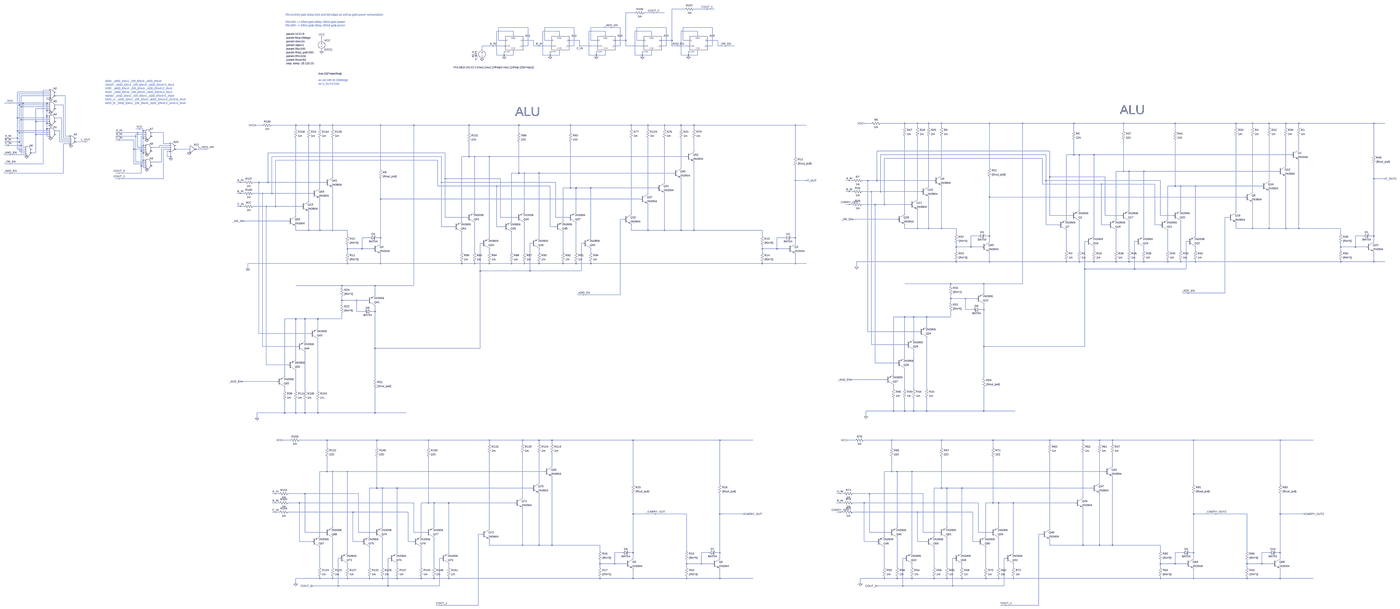
[diagram p0: schematic alu_2bit.asc, whole sheet]
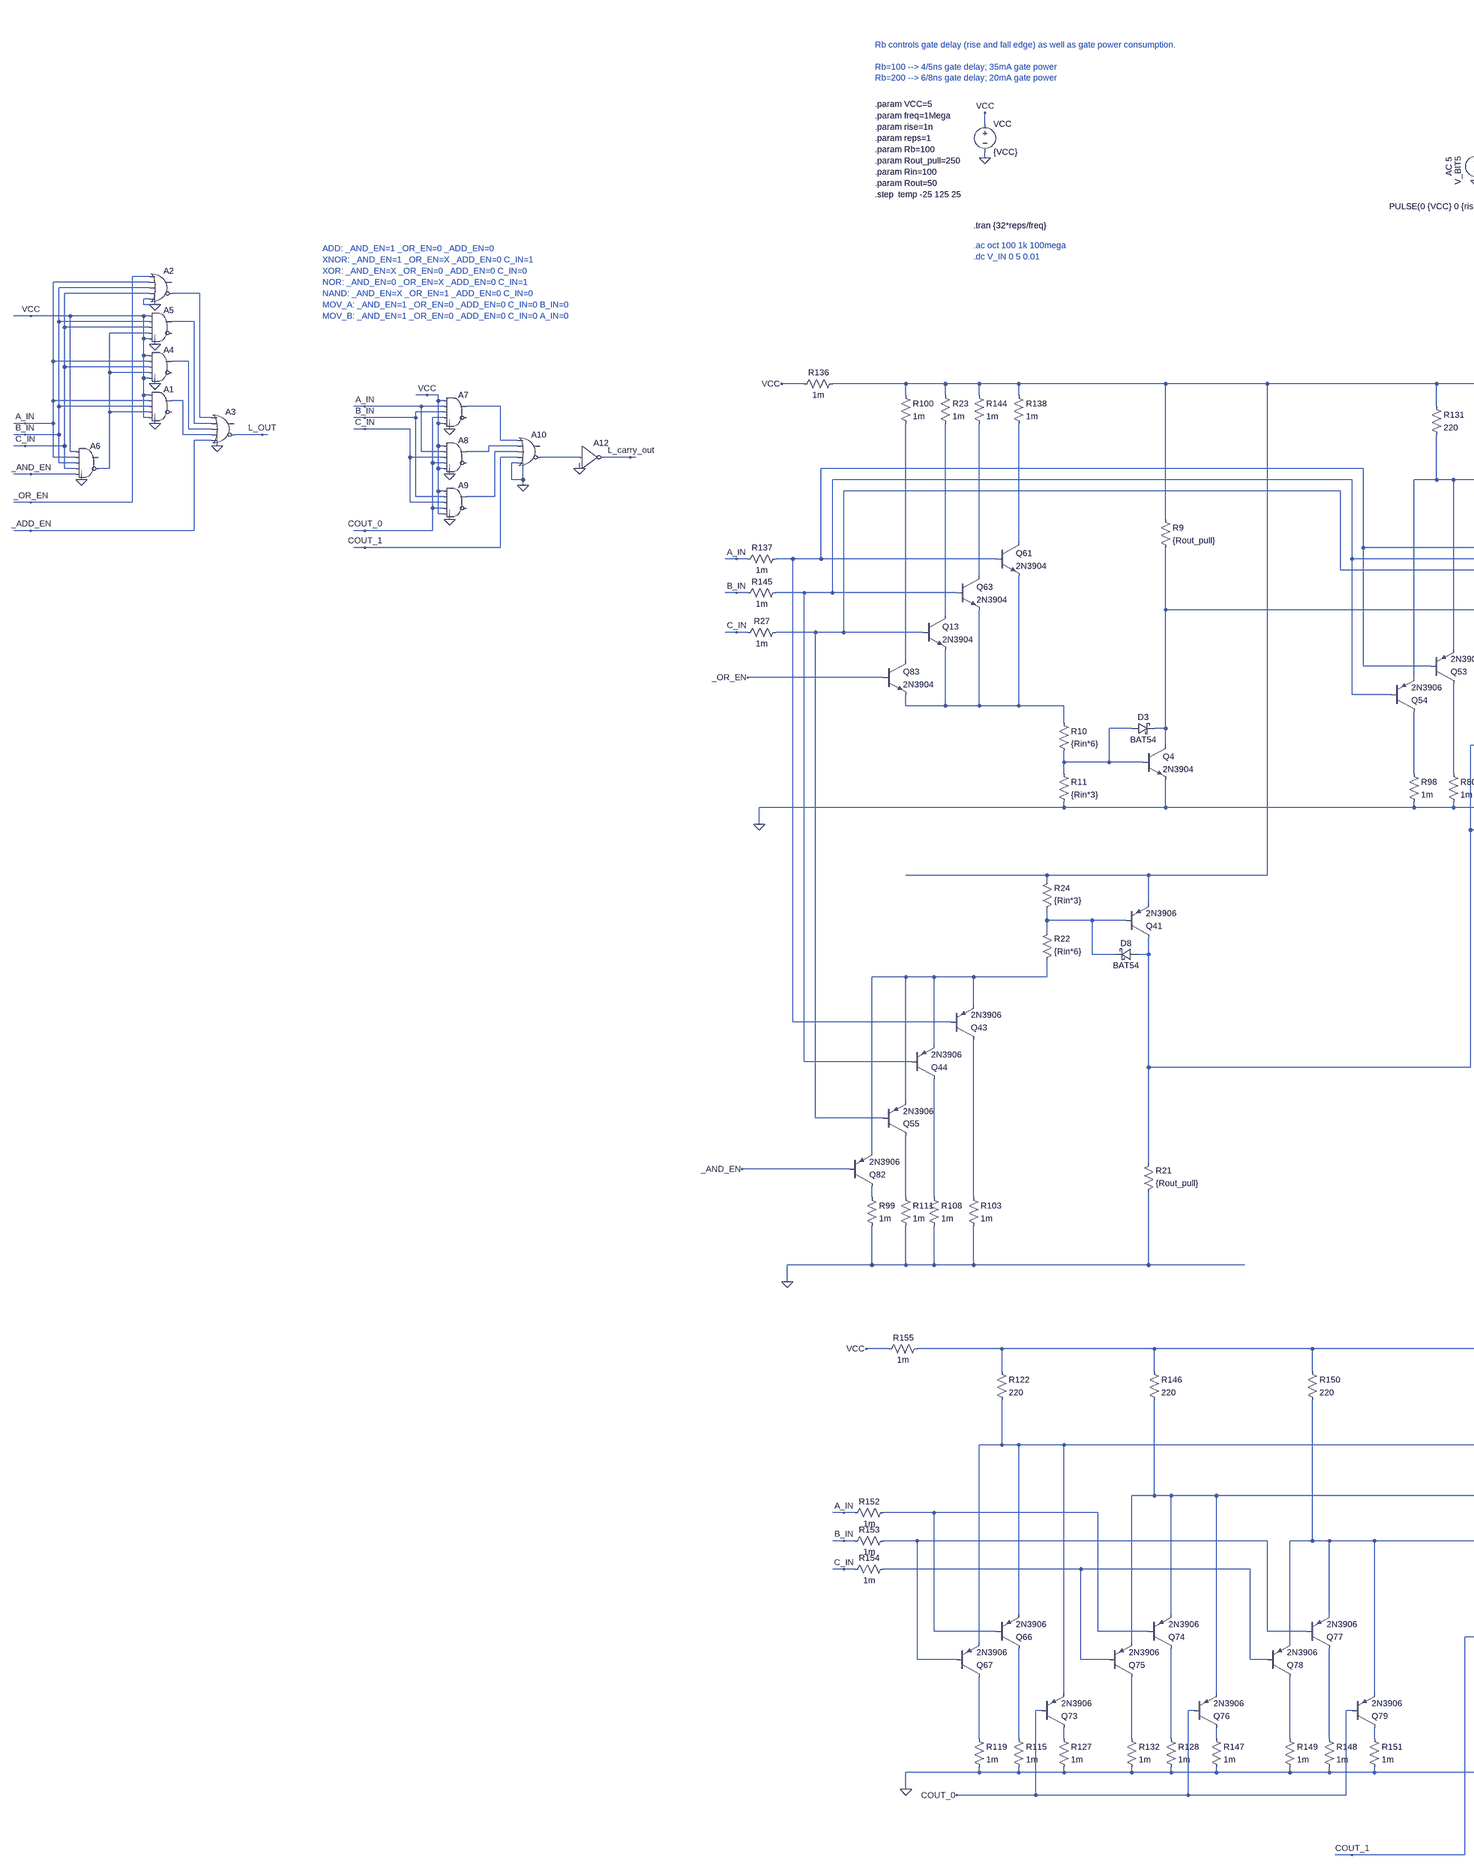
[diagram p1: schematic alu_2bit.asc, part, row 1 of 1, column 1 of 3]
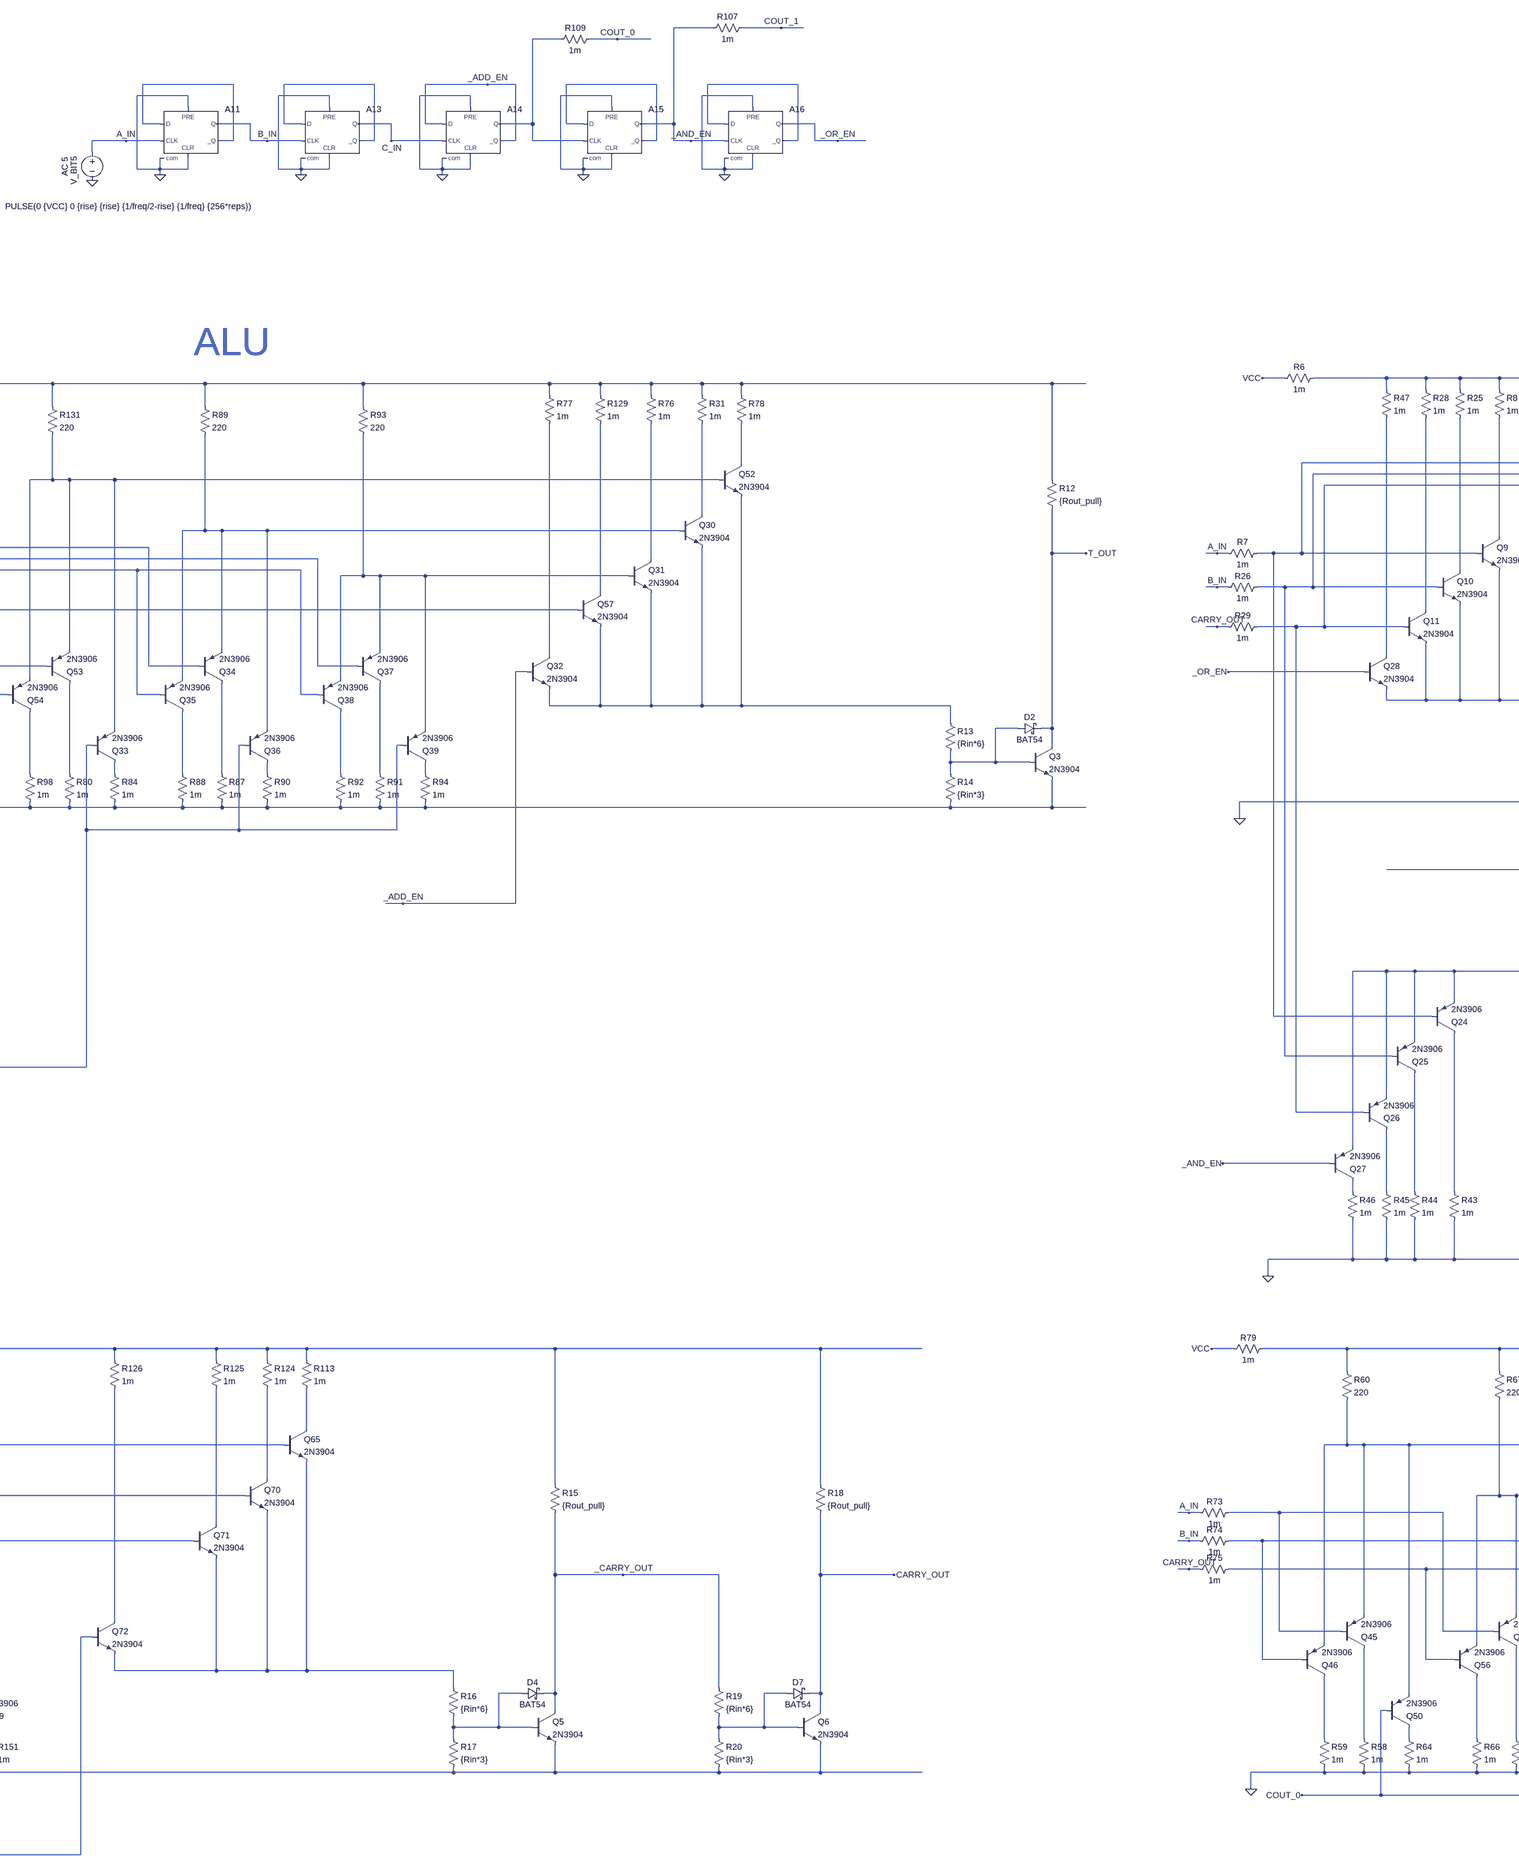
[diagram p2: schematic alu_2bit.asc, part, row 1 of 1, column 2 of 3]
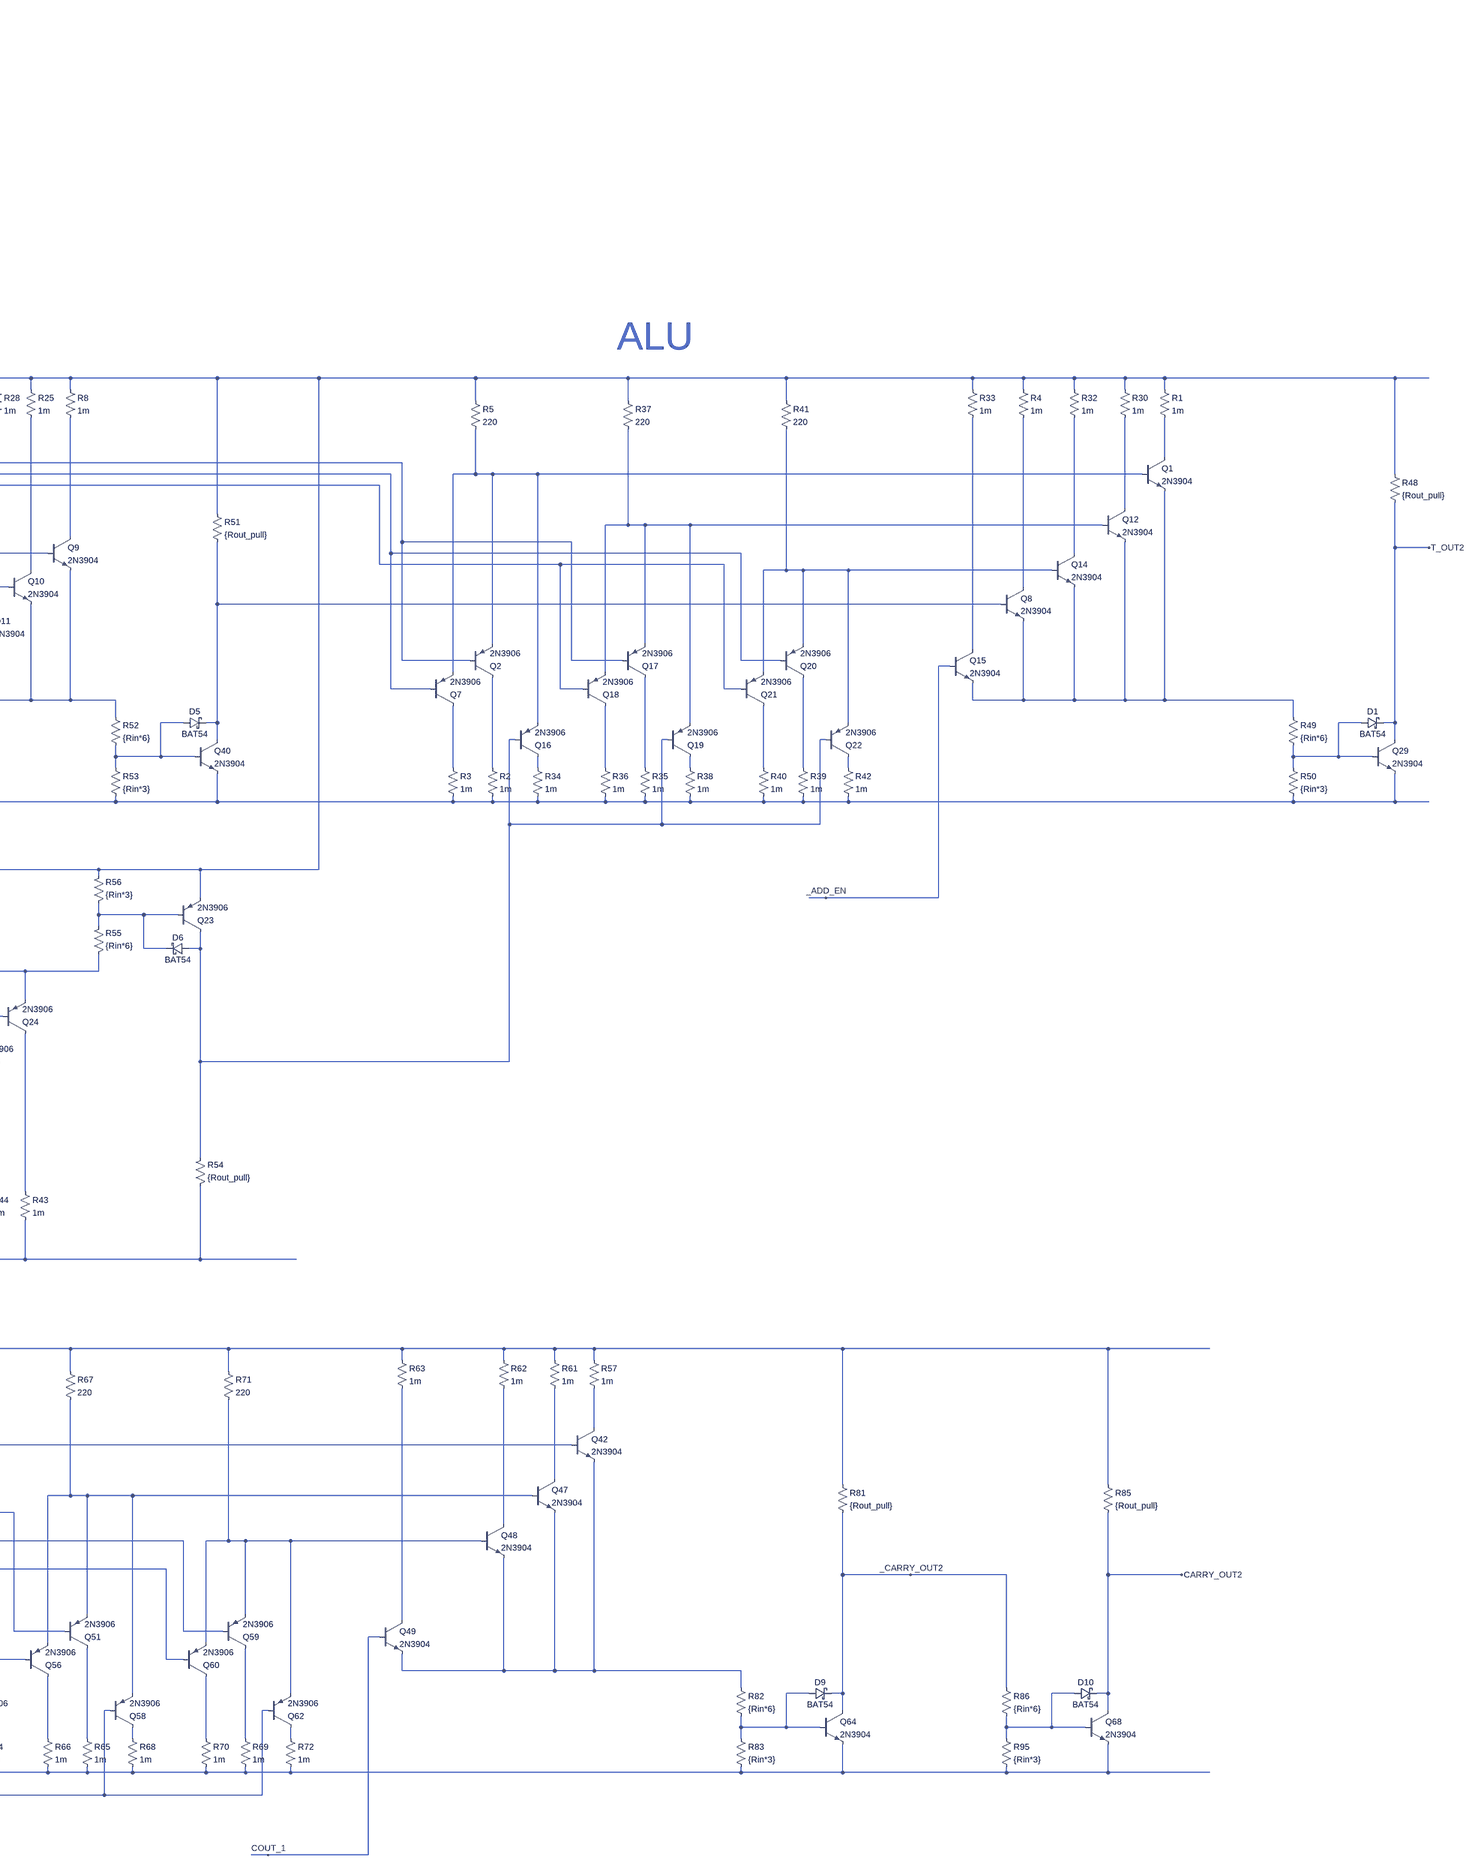
[diagram p3: schematic alu_2bit.asc, part, row 1 of 1, column 3 of 3]
* alu_2bit.asc
VCC VCC 0 {VCC}
Q52 N018 N024 N052 0 2N3904
Q53 N069 N020 N024 0 2N3906
R78 N011 N018 1m
R80 N069 0 1m
Q54 N068 N023 N024 0 2N3906
R98 N068 0 1m
R129 N011 N040 1m
Q57 N040 N042 N052 0 2N3904
R131 N011 N024 220
R136 VCC N011 1m
R137 A_IN N020 1m
Q61 N032 N020 N051 0 2N3904
R138 N011 N032 1m
Q63 N037 N023 N051 0 2N3904
R144 N011 N037 1m
R145 B_IN N023 1m
Q13 N044 N026 N051 0 2N3904
R23 N011 N044 1m
R27 C_IN N026 1m
Q30 N028 N030 N052 0 2N3904
Q31 N034 N038 N052 0 2N3904
Q32 N046 _ADD_EN N052 0 2N3904
R31 N011 N028 1m
R76 N011 N034 1m
R77 N011 N046 1m
Q33 N070 N058 N024 0 2N3906
R84 N070 0 1m
Q34 N072 N020 N030 0 2N3906
R87 N072 0 1m
Q35 N071 N026 N030 0 2N3906
R88 N071 0 1m
R89 N011 N030 220
Q36 N073 N058 N030 0 2N3906
R90 N073 0 1m
Q37 N075 N023 N038 0 2N3906
R91 N075 0 1m
Q38 N074 N026 N038 0 2N3906
R92 N074 0 1m
R93 N011 N038 220
Q39 N076 N058 N038 0 2N3906
R94 N076 0 1m
Q41 N058 N078 N011 0 2N3906
Q43 N088 N020 N080 0 2N3906
R103 N088 0 1m
Q44 N087 N023 N080 0 2N3906
R108 N087 0 1m
Q55 N086 N026 N080 0 2N3906
R111 N086 0 1m
Q65 N091 N093 N111 0 2N3904
Q66 N118 N099 N093 0 2N3906
R113 N089 N091 1m
R115 N118 0 1m
Q67 N117 N103 N093 0 2N3906
R119 N117 0 1m
R122 N089 N093 220
Q70 N095 N097 N111 0 2N3904
Q71 N101 N104 N111 0 2N3904
Q72 N109 COUT_1 N111 0 2N3904
R124 N089 N095 1m
R125 N089 N101 1m
R126 N089 N109 1m
Q73 N119 COUT_0 N093 0 2N3906
R127 N119 0 1m
Q74 N121 N099 N097 0 2N3906
R128 N121 0 1m
Q75 N120 N107 N097 0 2N3906
R132 N120 0 1m
R146 N089 N097 220
Q76 N122 COUT_0 N097 0 2N3906
R147 N122 0 1m
Q77 N124 N103 N104 0 2N3906
R148 N124 0 1m
Q78 N123 N107 N104 0 2N3906
R149 N123 0 1m
R150 N089 N104 220
Q79 N125 COUT_0 N104 0 2N3906
R151 N125 0 1m
R152 A_IN N099 1m
R153 B_IN N103 1m
R154 C_IN N107 1m
R155 VCC N089 1m
A1 VCC A_IN B_IN N008 VCC 0 N012 0 AND Vhigh={VCC}
A3 N006 N007 N009 N012 _ADD_EN L_OUT 0 0 OR Vhigh={VCC}
A4 VCC A_IN C_IN N008 VCC 0 N009 0 AND Vhigh={VCC}
A5 VCC B_IN C_IN N008 VCC 0 N007 0 AND Vhigh={VCC}
A2 _OR_EN A_IN B_IN C_IN 0 N006 0 0 OR Vhigh={VCC}
A6 VCC A_IN B_IN C_IN _AND_EN N008 0 0 AND Vhigh={VCC}
A7 VCC A_IN B_IN COUT_0 VCC 0 N013 0 AND Vhigh={VCC}
A8 VCC A_IN C_IN COUT_0 VCC 0 N014 0 AND Vhigh={VCC}
A9 VCC B_IN C_IN COUT_0 VCC 0 N015 0 AND Vhigh={VCC}
A10 N013 N014 N015 COUT_1 0 N016 0 0 OR Vhigh={VCC}
A12 N016 0 0 0 0 L_carry_out 0 0 BUF Vhigh={VCC}
V_BIT5 A_IN 0 PULSE(0 {VCC} 0 {rise} {rise} {1/freq/2-rise} {1/freq} {256*reps}) AC 5
A11 N002 0 A_IN 0 0 N002 B_IN 0 DFLOP Vhigh={VCC}
A13 N003 0 B_IN 0 0 N003 C_IN 0 DFLOP Vhigh={VCC}
A15 N004 0 N001 0 0 N004 _AND_EN 0 DFLOP Vhigh={VCC}
A16 N005 0 _AND_EN 0 0 N005 _OR_EN 0 DFLOP Vhigh={VCC}
A14 _ADD_EN 0 C_IN 0 0 _ADD_EN N001 0 DFLOP Vhigh={VCC}
Q82 N085 _AND_EN N080 0 2N3906
R99 N085 0 1m
Q83 N048 _OR_EN N051 0 2N3904
R100 N011 N048 1m
R107 COUT_1 _AND_EN 1m
R109 COUT_0 N001 1m
Q3 T_OUT N056 0 0 2N3904
D2 N056 T_OUT BAT54
R12 N011 T_OUT {Rout_pull}
R13 N052 N056 {Rin*6}
R14 N056 0 {Rin*3}
Q4 N042 N055 0 0 2N3904
D3 N055 N042 BAT54
R9 N011 N042 {Rout_pull}
R10 N051 N055 {Rin*6}
R11 N055 0 {Rin*3}
Q5 _CARRY_OUT N113 0 0 2N3904
D4 N113 _CARRY_OUT BAT54
R15 N089 _CARRY_OUT {Rout_pull}
R16 N111 N113 {Rin*6}
R17 N113 0 {Rin*3}
Q6 CARRY_OUT N114 0 0 2N3904
D7 N114 CARRY_OUT BAT54
R18 N089 CARRY_OUT {Rout_pull}
R19 _CARRY_OUT N114 {Rin*6}
R20 N114 0 {Rin*3}
D8 N058 N078 BAT54
R21 0 N058 {Rout_pull}
R22 N080 N078 {Rin*6}
R24 N078 N011 {Rin*3}
Q1 N017 N022 N050 0 2N3904
Q2 N060 N019 N022 0 2N3906
R1 N010 N017 1m
R2 N060 0 1m
Q7 N059 N021 N022 0 2N3906
R3 N059 0 1m
R4 N010 N039 1m
Q8 N039 N041 N050 0 2N3904
R5 N010 N022 220
R6 VCC N010 1m
R7 A_IN N019 1m
Q9 N031 N019 N049 0 2N3904
R8 N010 N031 1m
Q10 N035 N021 N049 0 2N3904
R25 N010 N035 1m
R26 B_IN N021 1m
Q11 N043 N025 N049 0 2N3904
R28 N010 N043 1m
R29 CARRY_OUT N025 1m
Q12 N027 N029 N050 0 2N3904
Q14 N033 N036 N050 0 2N3904
Q15 N045 _ADD_EN N050 0 2N3904
R30 N010 N027 1m
R32 N010 N033 1m
R33 N010 N045 1m
Q16 N061 N057 N022 0 2N3906
R34 N061 0 1m
Q17 N063 N019 N029 0 2N3906
R35 N063 0 1m
Q18 N062 N025 N029 0 2N3906
R36 N062 0 1m
R37 N010 N029 220
Q19 N064 N057 N029 0 2N3906
R38 N064 0 1m
Q20 N066 N021 N036 0 2N3906
R39 N066 0 1m
Q21 N065 N025 N036 0 2N3906
R40 N065 0 1m
R41 N010 N036 220
Q22 N067 N057 N036 0 2N3906
R42 N067 0 1m
Q23 N057 N077 N010 0 2N3906
Q24 N084 N019 N079 0 2N3906
R43 N084 0 1m
Q25 N083 N021 N079 0 2N3906
R44 N083 0 1m
Q26 N082 N025 N079 0 2N3906
R45 N082 0 1m
Q27 N081 _AND_EN N079 0 2N3906
R46 N081 0 1m
Q28 N047 _OR_EN N049 0 2N3904
R47 N010 N047 1m
Q29 T_OUT2 N054 0 0 2N3904
D1 N054 T_OUT2 BAT54
R48 N010 T_OUT2 {Rout_pull}
R49 N050 N054 {Rin*6}
R50 N054 0 {Rin*3}
Q40 N041 N053 0 0 2N3904
D5 N053 N041 BAT54
R51 N010 N041 {Rout_pull}
R52 N049 N053 {Rin*6}
R53 N053 0 {Rin*3}
D6 N057 N077 BAT54
R54 0 N057 {Rout_pull}
R55 N079 N077 {Rin*6}
R56 N077 N010 {Rin*3}
Q42 N092 N094 N112 0 2N3904
Q45 N127 N100 N094 0 2N3906
R57 N090 N092 1m
R58 N127 0 1m
Q46 N126 N105 N094 0 2N3906
R59 N126 0 1m
R60 N090 N094 220
Q47 N096 N098 N112 0 2N3904
Q48 N102 N106 N112 0 2N3904
Q49 N110 COUT_1 N112 0 2N3904
R61 N090 N096 1m
R62 N090 N102 1m
R63 N090 N110 1m
Q50 N128 COUT_0 N094 0 2N3906
R64 N128 0 1m
Q51 N130 N100 N098 0 2N3906
R65 N130 0 1m
Q56 N129 N108 N098 0 2N3906
R66 N129 0 1m
R67 N090 N098 220
Q58 N131 COUT_0 N098 0 2N3906
R68 N131 0 1m
Q59 N133 N105 N106 0 2N3906
R69 N133 0 1m
Q60 N132 N108 N106 0 2N3906
R70 N132 0 1m
R71 N090 N106 220
Q62 N134 COUT_0 N106 0 2N3906
R72 N134 0 1m
R73 A_IN N100 1m
R74 B_IN N105 1m
R75 CARRY_OUT N108 1m
R79 VCC N090 1m
Q64 _CARRY_OUT2 N115 0 0 2N3904
D9 N115 _CARRY_OUT2 BAT54
R81 N090 _CARRY_OUT2 {Rout_pull}
R82 N112 N115 {Rin*6}
R83 N115 0 {Rin*3}
Q68 CARRY_OUT2 N116 0 0 2N3904
D10 N116 CARRY_OUT2 BAT54
R85 N090 CARRY_OUT2 {Rout_pull}
R86 _CARRY_OUT2 N116 {Rin*6}
R95 N116 0 {Rin*3}
.model D D
.lib standard.dio
.model NPN NPN
.model PNP PNP
.lib standard.bjt
.tran {32*reps/freq}
* .ac oct 100 1k 100mega
* .dc V_IN 0 5 0.01
.param VCC=5
.param freq=1Mega
.param rise=1n
.param reps=1
.param Rb=100
* Rb controls gate delay (rise and fall edge) as well as gate power consumption.
* Rb=100 --> 4/5ns gate delay; 35mA gate power
* Rb=200 --> 6/8ns gate delay; 20mA gate power
* ALU
* ADD: _AND_EN=1 _OR_EN=0 _ADD_EN=0
* XNOR: _AND_EN=1 _OR_EN=X _ADD_EN=0 C_IN=1
* XOR: _AND_EN=X _OR_EN=0 _ADD_EN=0 C_IN=0
* NOR: _AND_EN=0 _OR_EN=X _ADD_EN=0 C_IN=1
* NAND: _AND_EN=X _OR_EN=1 _ADD_EN=0 C_IN=0
* MOV_A: _AND_EN=1 _OR_EN=0 _ADD_EN=0 C_IN=0 B_IN=0
* MOV_B: _AND_EN=1 _OR_EN=0 _ADD_EN=0 C_IN=0 A_IN=0
.param Rout_pull=250
.param Rin=100
.param Rout=50
.step  temp -25 125 25
* ALU
.backanno
.end